# Altium schematic sheet Sheet1.SchDoc
size A4; SheetNumber: 1; SheetTotal: 1
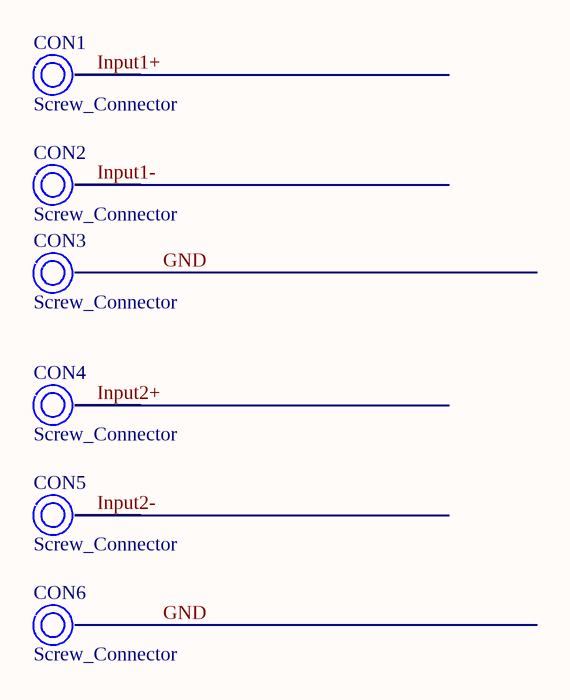
[diagram p0: Sheet1.SchDoc]

## Parts
CON1  Screw_Connector  [Screw6x6]
CON2  Screw_Connector  [Screw6x6]
CON3  Screw_Connector  [Screw6x6]
CON4  Screw_Connector  [Screw6x6]
CON5  Screw_Connector  [Screw6x6]
CON6  Screw_Connector  [Screw6x6]

## Nets
GND: CON3.1 CON6.1
Input1+: CON1.1
Input1-: CON2.1
Input2+: CON4.1
Input2-: CON5.1